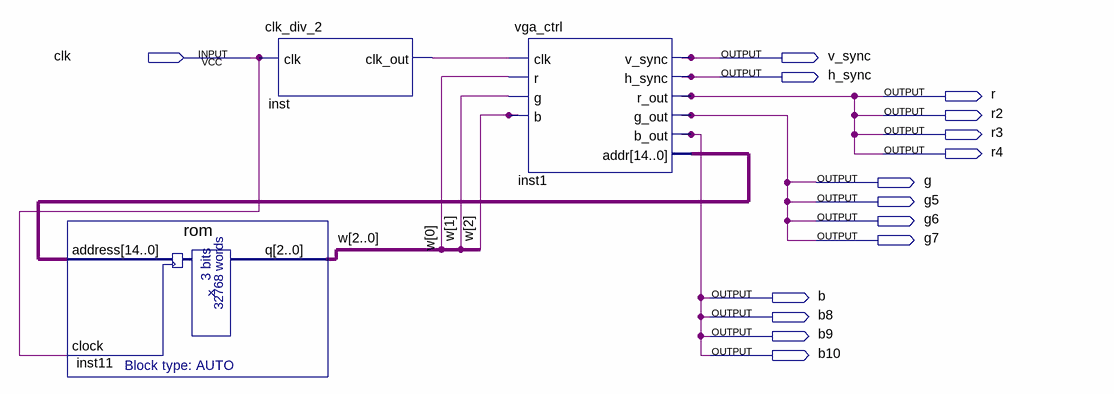
[diagram p0: schematic sheet]
// Quartus schematic vga.bdf as structural Verilog: 3 symbols, 15 pins
module vga (
  input  clk,
  output v_sync,
  output h_sync,
  output r,
  output r2,
  output r3,
  output r4,
  output g,
  output g5,
  output g6,
  output g7,
  output b,
  output b8,
  output b9,
  output b10
);

  wire inst_clk_out;
  wire [2:0] w;
  wire [14:0] inst1_addr;

  rom inst11 (.address(inst1_addr), .clock(clk), .q(w));
  clk_div_2 inst (.clk(clk), .clk_out(inst_clk_out));
  vga_ctrl inst1 (
    .clk(inst_clk_out), .r(w[0]), .g(w[1]), .b(w[2]), .v_sync(v_sync), .h_sync(h_sync), .r_out(r), .g_out(g),
    .b_out(b), .addr(inst1_addr));

  assign b8 = b;
  assign b9 = b;
  assign b10 = b;
  assign g5 = g;
  assign g6 = g;
  assign g7 = g;
  assign r2 = r;
  assign r3 = r;
  assign r4 = r;
endmodule
